# Altium schematic sheet Power_1.SchDoc
size A4; SheetNumber: 2; SheetTotal: 6
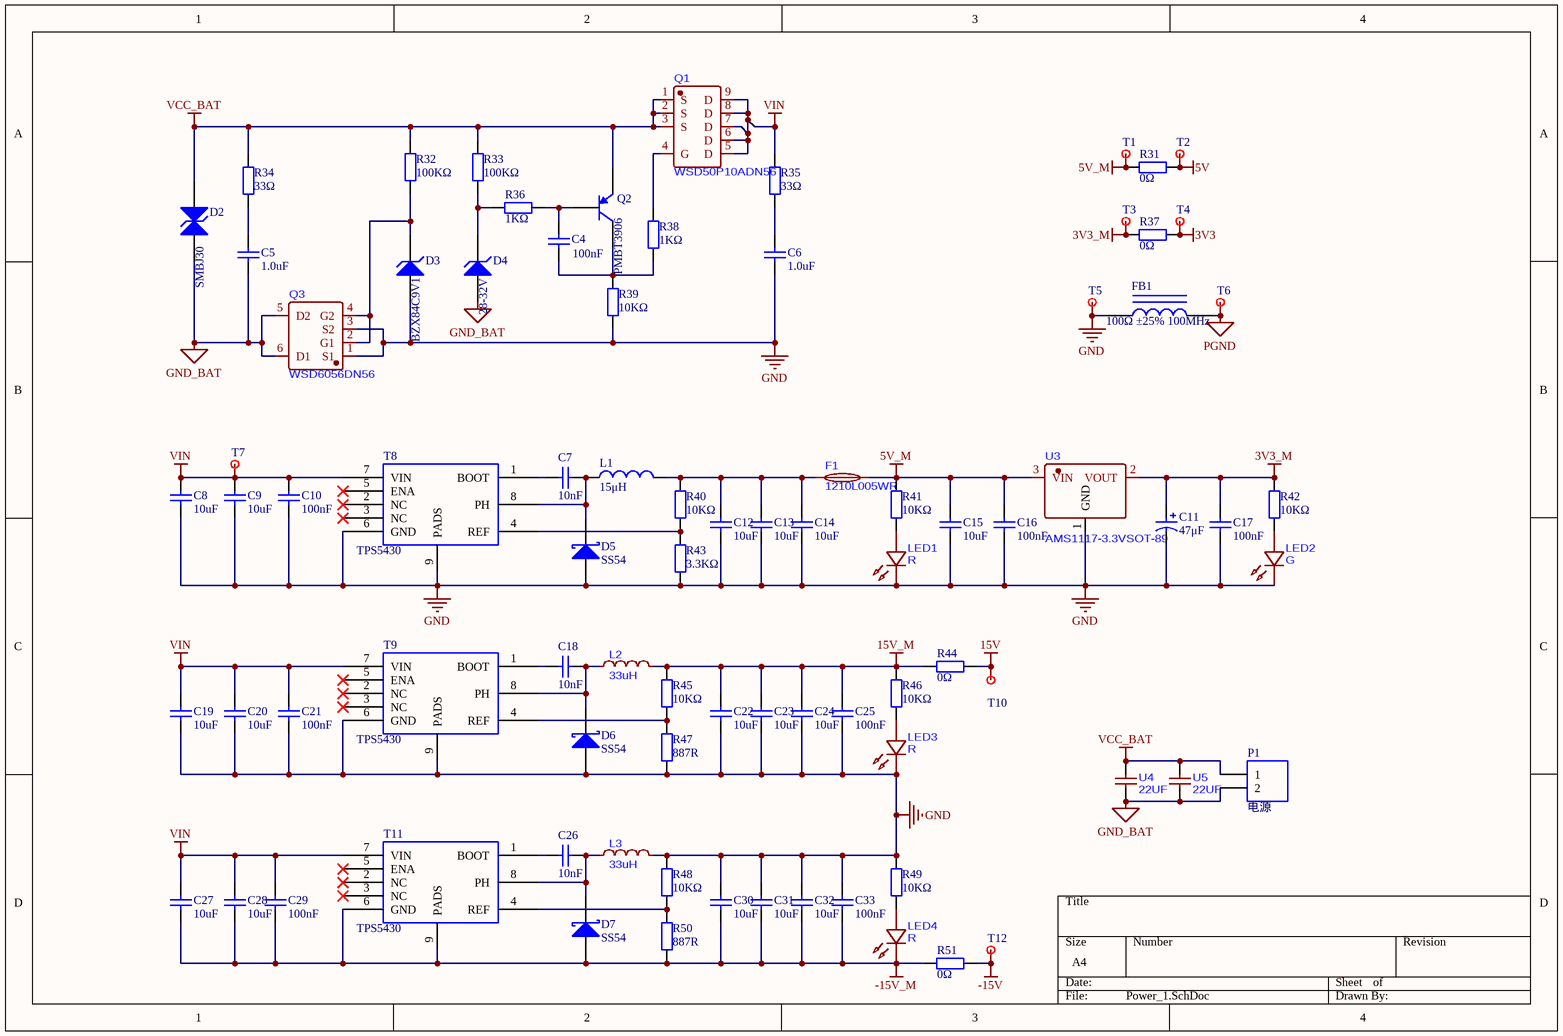
[diagram p0: Power_1.SchDoc]

## Parts
C4  100nF  [0402_C]
C5  1.0uF  [0402_C]
C6  1.0uF  [0402_C]
C7  10nF  [0402_C]
C8  10uF  [1206_C]
C9  10uF  [1206_C]
C10  100nF  [0603_C]
C11  47μF  [钽电容47]
C12  10uF  [1206_C]
C13  10uF  [1206_C]
C14  10uF  [1206_C]
C15  10uF  [0603_C]
C16  100nF  [0603_C]
C17  100nF  [0603_C]
C18  10nF  [0402_C]
C19  10uF  [1206_C]
C20  10uF  [1206_C]
C21  100nF  [0603_C]
C22  10uF  [1206_C]
C23  10uF  [1206_C]
C24  10uF  [1206_C]
C25  100nF  [0603_C]
C26  10nF  [0402_C]
C27  10uF  [1206_C]
C28  10uF  [1206_C]
C29  100nF  [0603_C]
C30  10uF  [1206_C]
C31  10uF  [1206_C]
C32  10uF  [1206_C]
C33  100nF  [0603_C]
D2  SMBJ30  [SMB(DO-214AA)_S1]
D3  BZX84C9V1  [SOD-123]
D4  28-32V  [SOD-123]
D5  SS54  [SS54]
D6  SS54  [SS54]
D7  SS54  [SS54]
F1  1210L005WR  [F1210]
FB1  100Ω ±25% 100MHz  [0805_L]
L1  15μH  [电感]
L2  33uH  [IND-SMD_L5.5-W5.0]
L3  33uH  [IND-SMD_L5.5-W5.0]
LED1  R  [LED0402-RD]
LED2  G  [LED0402-RD]
LED3  R  [LED0402-RD]
LED4  R  [LED0402-RD]
P1  电源  [XT30U公头]
Q1  WSD50P10ADN56  [DFN-8_L5.8-W4.9-P1.27-LS6.0-BL-1]
Q2  PMBT3906  [SOT-23]
Q3  WSD6056DN56  [DFN-8_L5.5-W5.2-P1.27-LS6.0-BL-EP2]
R31  0Ω  [0603_R]
R32  100KΩ  [0402_R]
R33  100KΩ  [0402_R]
R34  33Ω  [0402_R]
R35  33Ω  [0402_R]
R36  1KΩ  [0402_R]
R37  0Ω  [0603_R]
R38  1KΩ  [0402_R]
R39  10KΩ  [0402_R]
R40  10KΩ  [0402_R]
R41  10KΩ  [0402_R]
R42  10KΩ  [0402_R]
R43  3.3KΩ  [0402_R]
R44  0Ω  [0603_R]
R45  10KΩ  [0402_R]
R46  10KΩ  [0402_R]
R47  887R  [0402_R]
R48  10KΩ  [0402_R]
R49  10KΩ  [0402_R]
R50  887R  [0402_R]
R51  0Ω  [0603_R]
T1  testpoint  [testpoint]  (value not drawn)
T2  testpoint  [testpoint]  (value not drawn)
T3  testpoint  [testpoint]  (value not drawn)
T4  testpoint  [testpoint]  (value not drawn)
T5  testpoint  [testpoint]  (value not drawn)
T6  testpoint  [testpoint]  (value not drawn)
T7  testpoint  [testpoint]  (value not drawn)
T8  TPS5430  [TPS5430DDAR]
T9  TPS5430  [TPS5430DDAR]
T10  testpoint  [testpoint]  (value not drawn)
T11  TPS5430  [TPS5430DDAR]
T12  testpoint  [testpoint]  (value not drawn)
U3  AMS1117-3.3VSOT-89  [SOT-89-3_L4.5-W2.5-P1.50-LS4.2-BR]
U4  22UF  [C1812]
U5  22UF  [C1812]

## Nets
3V3: R37.2 T4.1(R)
3V3_M: C11.1 C17.2 R37.1 R42.2 T3.1(R) U3.2(VOUT)
5V: R31.2 T2.1(R)
5V_M: C15.2 C16.2 F1.2 R31.1 R41.2 T1.1(R) U3.3(VIN)
15V: R44.2 T10.1(R)
15V_M: C22.2 C23.2 C24.2 C25.2 L2.2 R44.1 R45.2 R46.2
-15V: R51.2 T12.1(R)
-15V_M: C27.1 C28.1 C29.1 C30.1 C31.1 C32.1 C33.1 D7.1(A) LED4.1(K) R50.1 R51.1 T11.6(GND) T11.9(PADS)
GND: C6.1 C8.1 C9.1 C10.1 C11.2 C12.1 C13.1 C14.1 C15.1 C16.1 C17.1 C19.1 C20.1 C21.1 C22.1 C23.1 C24.1 C25.1 C30.2 C31.2 C32.2 C33.2 D3.1(A) D5.1(A) D6.1(A) FB1.1 L3.2 LED1.1(K) LED2.1(K) LED3.1(K) Q3.1(S1) Q3.3(S2) R39.2 R43.1 R47.1 R48.2 R49.2 T5.1(R) T8.6(GND) T8.9(PADS) T9.6(GND) T9.9(PADS) U3.1(GND)
GND_BAT: C5.1 D2.1(A) D4.1(A) P1.2 Q3.5(D2) Q3.6(D1) U4.1 U5.1
PGND: FB1.2 T6.1(R)
VCC_BAT: D2.2(K) P1.1 Q1.1(S) Q1.2(S) Q1.3(S) Q2.2(E) R32.2 R33.2 R34.2 U4.2 U5.2
VIN: C8.2 C9.2 C10.2 C19.2 C20.2 C21.2 C27.2 C28.2 C29.2 Q1.5(D) Q1.6(D) Q1.7(D) Q1.8(D) Q1.9(D) R35.2 T7.1(R) T8.7(VIN) T9.7(VIN) T11.7(VIN)
NetC4_1: C4.1 Q2.3(C) R38.1 R39.1
NetC4_2: C4.2 Q2.1(B) R36.2
NetC5_2: C5.2 R34.1
NetC6_2: C6.2 R35.1
NetC7_1: C7.1 T8.1(BOOT)
NetC7_2: C7.2 D5.2(K) L1.1 T8.8(PH)
NetC12_2: C12.2 C13.2 C14.2 F1.1 L1.2 R40.2
NetC18_1: C18.1 T9.1(BOOT)
NetC18_2: C18.2 D6.2(K) L2.1 T9.8(PH)
NetC26_1: C26.1 T11.1(BOOT)
NetC26_2: C26.2 D7.2(K) L3.1 T11.8(PH)
NetD3_2: D3.2(K) Q3.2(G1) Q3.4(G2) R32.1
NetD4_2: D4.2(K) R33.1 R36.1
NetLED1_2: LED1.2(A) R41.1
NetLED2_2: LED2.2(A) R42.1
NetLED3_2: LED3.2(A) R46.1
NetLED4_2: LED4.2(A) R49.1
NetQ1_4: Q1.4(G) R38.2
NetR40_1: R40.1 R43.2 T8.4(REF)
NetR45_1: R45.1 R47.2 T9.4(REF)
NetR48_1: R48.1 R50.2 T11.4(REF)

Not connected (* = marked no-connect by the designer): T8 2(NC)* 3(NC)* 5(ENA)*; T9 2(NC)* 3(NC)* 5(ENA)*; T11 2(NC)* 3(NC)* 5(ENA)*

## Library data of the parts
C4 = 0402 100nF (104) 10% 16V: 贴片电容; ComponentLink1Description: 供应商链接; ComponentLink1URL: http://www.szlcsc.com/product/details_1877.html; Package: 0402; Supplier: LC; SuppliersPartNumber: C1525
C5 C6 = 0402 1.0uF (105) 10% 25V: 贴片电容; ComponentLink1Description: 供应商链接; ComponentLink1URL: http://www.szlcsc.com/product/details_53938.html; Package: 0402; Supplier: LC; SuppliersPartNumber: C52923
C7 C18 C26 = 0402 10nF (103) 10% 50V: 贴片电容; ComponentLink1Description: 供应商链接; ComponentLink1URL: http://www.szlcsc.com/product/details_15869.html; Package: 0402; Supplier: LC; SuppliersPartNumber: C15195
C8 C9 C12-C14 C19 C20 C22-C24 C27 C28 C30-C32 = 1206 10uF (106) 10% 50V: 贴片电容; ComponentLink1Description: 供应商链接; ComponentLink1URL: http://www.szlcsc.com/product/details_14236.html; Package: 1206; Supplier: LC; SuppliersPartNumber: C13585
C10 C15-C17 C21 C25 C29 C33 = 0603 100nF (104) 10% 50V: 贴片电容; ComponentLink1Description: 供应商链接; ComponentLink1URL: http://www.szlcsc.com/product/details_15331.html; Package: 0603; Supplier: LC; SuppliersPartNumber: C14663
C11 = 47μF: 钽电容; Published: 8-Jun-2000; LatestRevisionDate: 29-May-2009; LatestRevisionNote: IPC-7351 Footprint Added.; PackageReference: C0805; Publisher: Altium Limited; PackageDescription: Chip Capacitor
D2 = SMB/DO-214AA P6SMB6.8CA: TVS; ComponentLink1Description: 供应商链接; ComponentLink1URL: http://www.szlcsc.com/product/details_79530.html; Package: SMB/DO-214AA; Supplier: LC; SuppliersPartNumber: C78395
D3 D4 = 稳压二极管: ComponentLink1Description: 供应商链接; ComponentLink1URL: http://www.szlcsc.com/product/details_8541.html; Package: LL-34; Supplier: LC; SuppliersPartNumber: C8062
D5-D7 = SS54: Schottky Diode; Published: 8-Jun-2000; LatestRevisionDate: 17-Jul-2002; LatestRevisionNote: Re-released for DXP Platform.; PackageReference: SMB; Publisher: Altium Limited; PackageDescription: DO-214-AA/SMB; 2 C-Bend Leads; Body 5.3 x 3.6 mm, inc. leads (LxW); Code_JEDEC: DO-214-AA
FB1 = 0805 100Ω 25% 100MHz: 贴片磁珠; ComponentLink1Description: 供应商链接; ComponentLink1URL: http://www.szlcsc.com/product/details_1367.html; Package: 0805; Supplier: LC; SuppliersPartNumber: C1015
L1 = 15μH: 贴片电感; Code_IEC: 1005; Published: 8-Jun-2000; LatestRevisionDate: 29-May-2009; LatestRevisionNote: IPC-7351 Footprint Added.; PackageReference: 0402-A; Publisher: Altium Limited; PackageDescription: Chip Inductor; Code_JEITA: 0402
L2 L3 = YXMAC0502-3R3M-ANF
LED1-LED4 = TJ-S1005CL4T5ALC3DW-A5
P1 = XT30公头立式: Header, 2-Pin; LatestRevisionDate: 17-Jul-2002; LatestRevisionNote: Re-released for DXP Platform.; Publisher: Altium Limited
Q2 = PNP三极管: 三极管; ComponentLink1Description: 供应商链接; ComponentLink1URL: http://www.szlcsc.com/product/details_9037.html; Package: SOT-23; Supplier: LC; SuppliersPartNumber: C8542
R31 R37 R44 R51 = 0603 0Ω (0R0) 1%: 贴片电阻; ComponentLink1Description: 供应商链接; ComponentLink1URL: http://www.szlcsc.com/product/details_21903.html; Package: 0603; Supplier: LC; SuppliersPartNumber: C21189
R32 R33 = 0402 100KΩ (1003) 1%: 贴片电阻; ComponentLink1Description: 供应商链接; ComponentLink1URL: http://www.szlcsc.com/product/details_26484.html; Package: 0402; Supplier: LC; SuppliersPartNumber: C25741
R34 R35 = 0402 33Ω (33R0) 1%: 贴片电阻; ComponentLink1Description: 供应商链接; ComponentLink1URL: http://www.szlcsc.com/product/details_25848.html; Package: 0402; Supplier: LC; SuppliersPartNumber: C25105
R36 R38 = 0402 1KΩ (1001) 1%: 贴片电阻; ComponentLink1Description: 供应商链接; ComponentLink1URL: http://www.szlcsc.com/product/details_12256.html; Package: 0402; Supplier: LC; SuppliersPartNumber: C11702
R39-R42 R45 R46 R48 R49 = 0402 10KΩ (1002) 1%: 贴片电阻; ComponentLink1Description: 供应商链接; ComponentLink1URL: http://www.szlcsc.com/product/details_26487.html; Package: 0402; Supplier: LC; SuppliersPartNumber: C25744
R43 R47 R50 = 0402 3.3KΩ (3301) 1%: 贴片电阻; ComponentLink1Description: 供应商链接; ComponentLink1URL: http://www.szlcsc.com/product/details_26633.html; Package: 0402; Supplier: LC; SuppliersPartNumber: C25890
T8 T9 T11 = TPS5430: 24V-5V
U4 U5 = 100UF/50V-1812